# EAGLE design board-forblock (EAGLE 9.5.2)
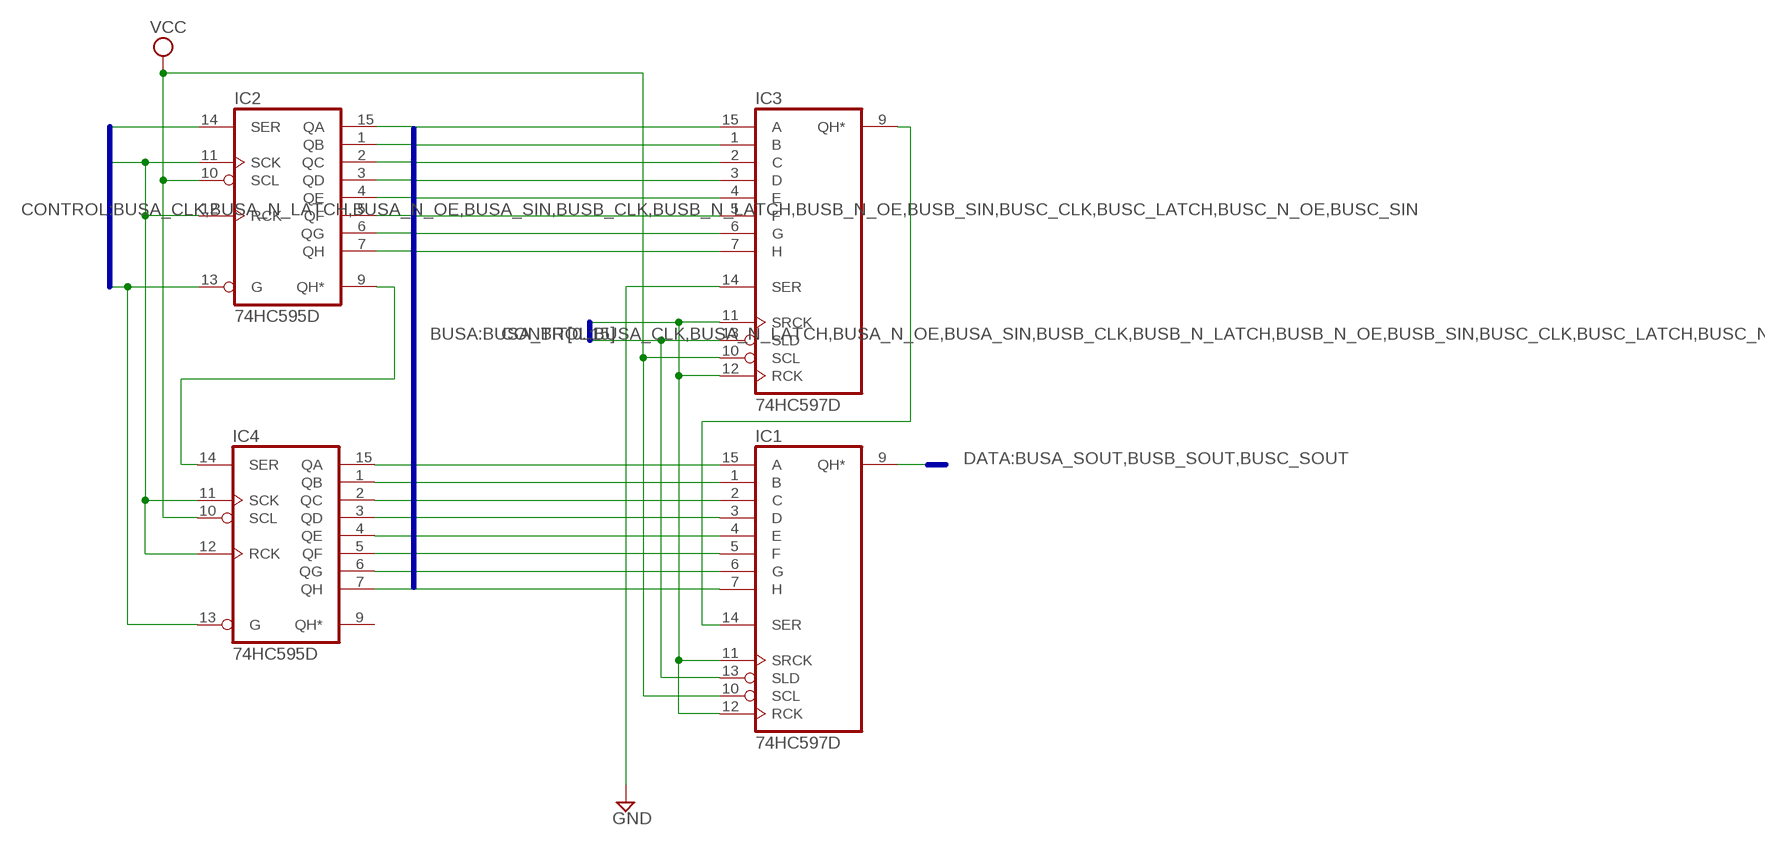
[diagram p0: schematic, sheet 1]

## Parts
IC1  74HC597D  [SO16]
IC2  74HC595D  [SO16]
IC3  74HC597D  [SO16]
IC4  74HC595D  [SO16]

## Nets
BUSA_BIT0: IC2.15(QA) IC3.15(A)
BUSA_BIT1: IC2.1(QB) IC3.1(B)
BUSA_BIT2: IC2.2(QC) IC3.2(C)
BUSA_BIT3: IC2.3(QD) IC3.3(D)
BUSA_BIT4: IC2.4(QE) IC3.4(E)
BUSA_BIT5: IC2.5(QF) IC3.5(F)
BUSA_BIT6: IC2.6(QG) IC3.6(G)
BUSA_BIT7: IC2.7(QH) IC3.7(H)
BUSA_BIT8: IC1.15(A) IC4.15(QA)
BUSA_BIT9: IC1.1(B) IC4.1(QB)
BUSA_BIT10: IC1.2(C) IC4.2(QC)
BUSA_BIT11: IC1.3(D) IC4.3(QD)
BUSA_BIT12: IC1.4(E) IC4.4(QE)
BUSA_BIT13: IC1.5(F) IC4.5(QF)
BUSA_BIT14: IC1.6(G) IC4.6(QG)
BUSA_BIT15: IC1.7(H) IC4.7(QH)
BUSA_CLK: IC1.11(SRCK) IC1.12(RCK) IC2.11(SCK) IC2.12(RCK) IC3.11(SRCK) IC3.12(RCK) IC4.11(SCK) IC4.12(RCK)
BUSA_N_LATCH: IC1.13(SLD) IC3.13(SLD)
BUSA_N_OE: IC2.13(G) IC4.13(G)
BUSA_SIN: IC2.14(SER)
BUSA_SOUT: IC1.9(QH*)
GND: IC3.14(SER)
N$1: IC2.9(QH*) IC4.14(SER)
N$2: IC1.14(SER) IC3.9(QH*)
VCC: IC1.10(SCL) IC2.10(SCL) IC3.10(SCL) IC4.10(SCL)
Unconnected: IC4.9(QH*)

## Buses
BUSA:BUSA_BIT[0..15]
CONTROL:BUSA_CLK,BUSA_N_LATCH,BUSA_N_OE,BUSA_SIN,BUSB_CLK,BUSB_N_LATCH,BUSB_N_OE,BUSB_SIN,BUSC_CLK,BUSC_LATCH,BUSC_N_OE,BUSC_SIN
DATA:BUSA_SOUT,BUSB_SOUT,BUSC_SOUT

## Power pins joined to a net without a drawn wire
GND: IC1.8(GND) IC2.8(GND) IC3.8(GND) IC4.8(GND)
VCC: IC1.16(VCC) IC2.16(VCC) IC3.16(VCC) IC4.16(VCC)

## Library data of the parts
IC1 IC3 = 74xx-eu:74*597: 8-bit SHIFT REGISTER, input latch
IC2 IC4 = 74xx-eu:74*595: 8-bit SHIFT REGISTER, output latch

## Board
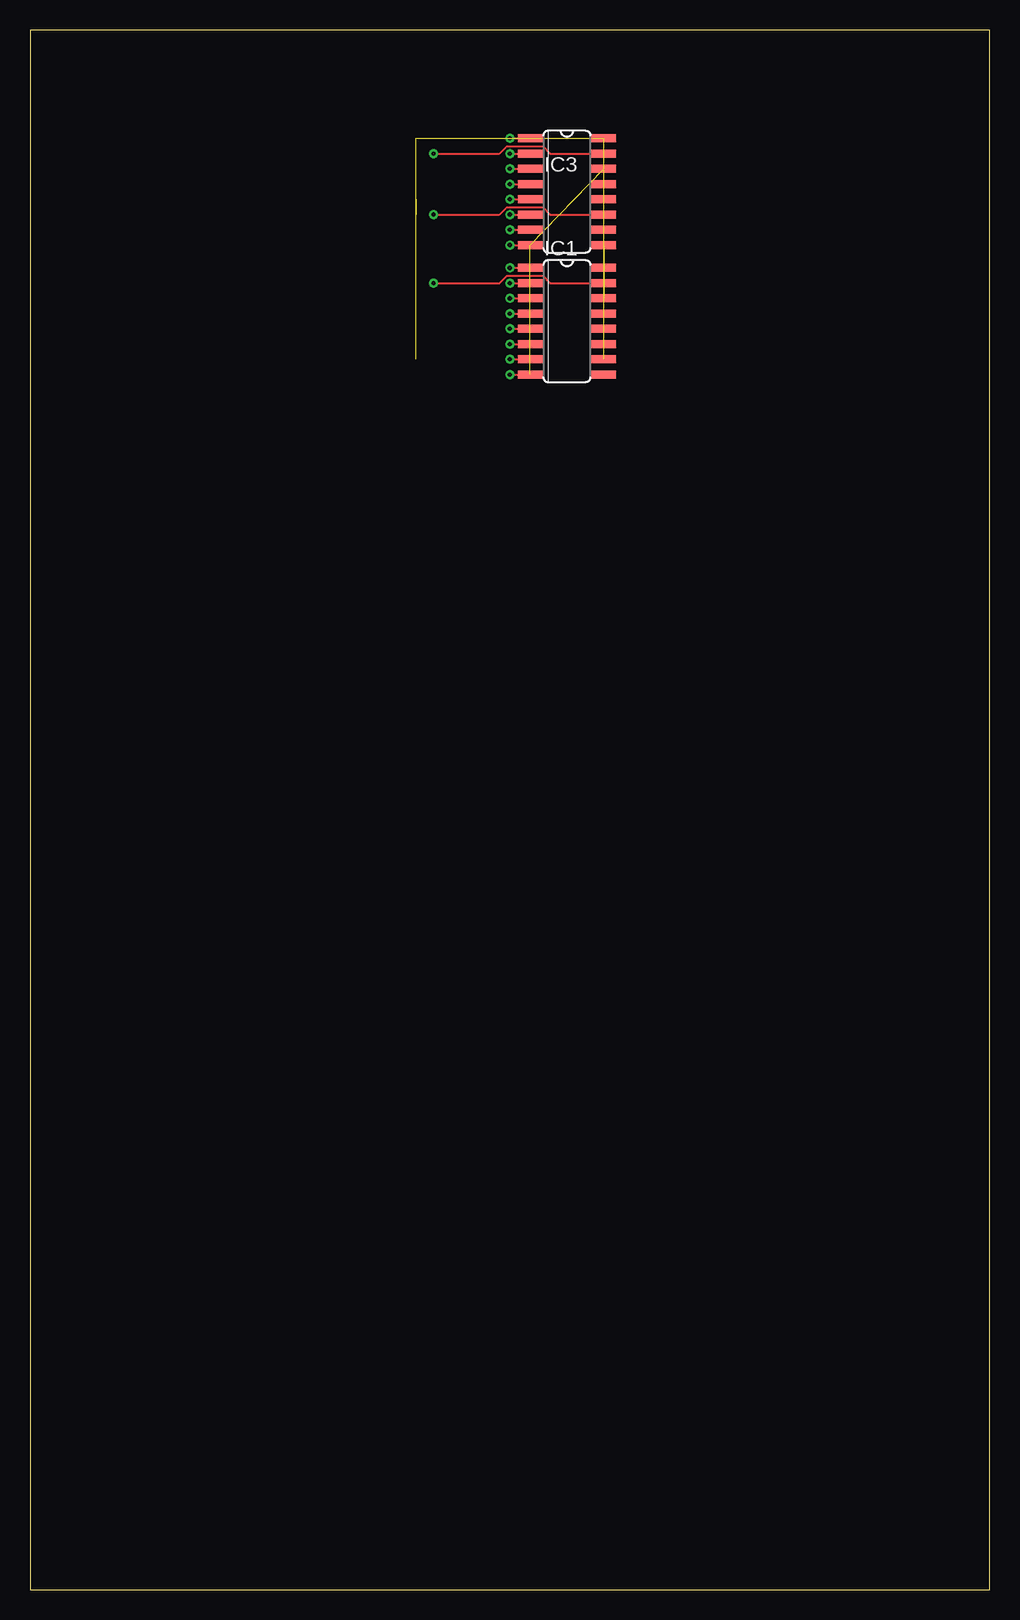
[diagram p1: board, top side]
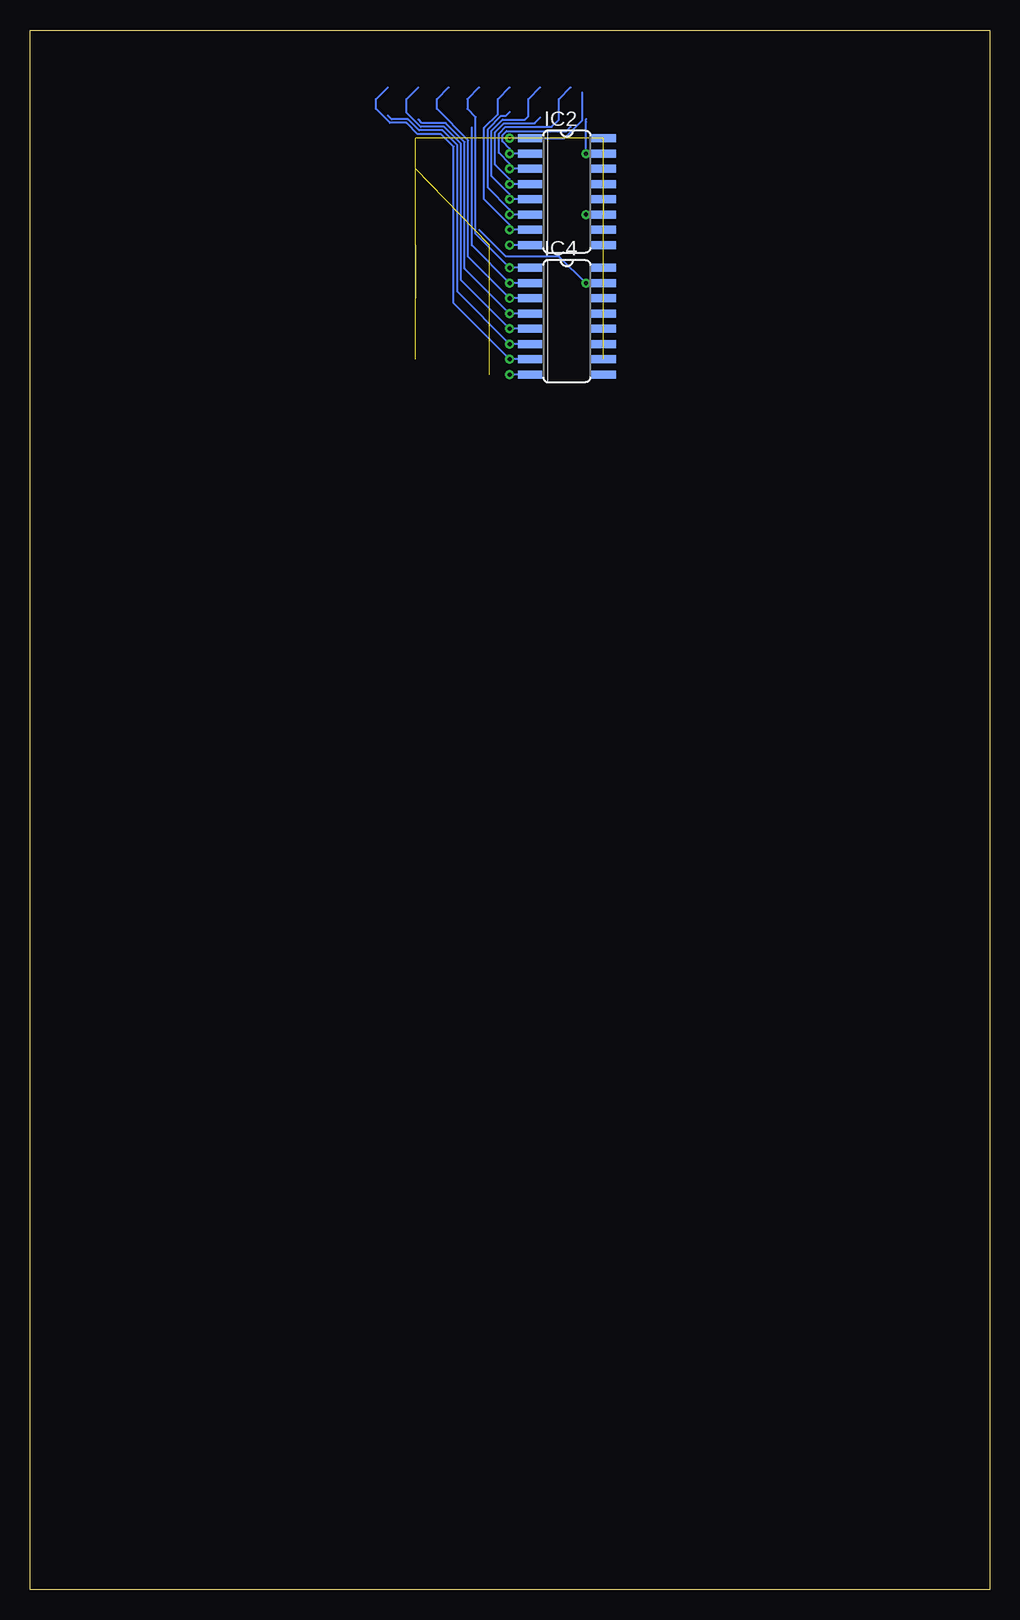
[diagram p2: board, bottom side, seen from below]

Size 80 x 130 mm. Coordinates in mm from the lower left corner, seen from the top.
Outline: 0,0 80,0 80,130 0,130 0,0
Copper layers (1*16): Top 0.035mm / dielectric 1.5mm / Bottom 0.035mm
Design rules "default": minimum track width 6mil, minimum drill 0.35mm, track to track 6mil, track to pad 6mil, pad to pad 6mil, via to via 6mil, smd to smd 6mil, copper to edge 40mil, drill to drill 6mil, minimum pad ring 10mil, minimum via ring 8mil, stop-mask expansion 4mil, vias tented up to drill 0mil, thermal gap 10mil

### Footprints (pad centres in the part's own frame; a part is rotated, then mirrored left to right if it is on the bottom)
SO16 = smd 0.66 x 2.032: 1 -4.445,-3.073; 2 -3.175,-3.073; 3 -1.905,-3.073; 4 -0.635,-3.073; 5 0.635,-3.073; 6 1.905,-3.073; 7 3.175,-3.073; 8 4.445,-3.073; 9 4.445,3.073; 10 3.175,3.073; 11 1.905,3.073; 12 0.635,3.073; 13 -0.635,3.073; 14 -1.905,3.073; 15 -3.175,3.073; 16 -4.445,3.073

### Placement (x,y rotation side)
IC1  44.77,105.73 270 top
IC2  35.24,116.52 270 bottom
IC3  44.77,116.52 270 top
IC4  35.24,105.73 270 bottom

### Tracks (layer width: path | path; a pad name or v marks a point on that pad's centre or on a via)
BUSA_BIT0  (via drill 0.35)  (1 unrouted)
  Top 0.152: v33.66,119.7 39.15,119.7 39.75,120.3 42.76,120.3 43.36,119.7 IC3.15
  Bottom 0.152: IC2.15 v33.66,119.7 33.66,122.33 33.64,122.34 33.64,122.57
BUSA_BIT1  (via drill 0.35)
  Top 0.152: v40.01,120.97 IC3.1
  Bottom 0.152: v40.01,120.97 IC2.1 35.45,120.97 33.94,122.47 33.94,124.81
BUSA_BIT2  (via drill 0.35)
  Top 0.152: v40.01,119.7 IC3.2
  Bottom 0.152: IC2.2 v40.01,119.7 40.01,120.11 40.61,120.72 40.61,121.22 40.26,121.57 35.27,121.57 34.92,121.92
BUSA_BIT3  (via drill 0.35)
  Top 0.152: v40.01,118.43 IC3.3
  Bottom 0.152: IC2.3 v40.01,118.43 40.01,118.84 40.92,119.75 40.92,121.34 40.34,121.92 36.51,121.92 35.91,122.53 35.91,124.23 34.92,125.22
BUSA_BIT4  (via drill 0.35)
  Top 0.152: v40.01,117.16 IC3.4
  Bottom 0.152: IC2.4 v40.01,117.16 40.01,117.57 41.22,118.79 41.22,121.47 40.47,122.22 37.94,122.22 37.47,122.69
BUSA_BIT5  (via drill 0.35)
  Top 0.152: v40.01,115.89 IC3.5
  Bottom 0.152: IC2.5 v40.01,115.89 40.01,116.3 41.53,117.82 41.53,121.6 40.59,122.53 38.73,122.53 38.45,122.82 38.45,124.23 37.47,125.22
BUSA_BIT6  (via drill 0.35)
  Top 0.152: v40.01,114.62 IC3.6
  Bottom 0.152: IC2.6 v40.01,114.62 40.01,115.03 41.83,116.86 41.83,121.72 40.72,122.83 40.32,122.83 40.01,123.15
BUSA_BIT7  (via drill 0.35)
  Top 0.152: v40.01,113.35 IC3.7
  Bottom 0.152: IC2.7 v40.01,113.35 40.01,113.76 42.14,115.89 42.14,121.85 40.99,123 40.99,124.23 40.01,125.22
BUSA_BIT8  (via drill 0.35)  (1 unrouted)
  Top 0.152: v33.66,108.9 39.15,108.9 39.75,109.51 42.76,109.51 43.36,108.9 IC1.15
  Bottom 0.152: IC4.15 v33.66,108.9 35.88,111.12 40.32,111.12 42.55,113.35
BUSA_BIT9  (via drill 0.35)
  Top 0.152: v40.01,110.17 IC1.1
  Bottom 0.152: IC4.1 v40.01,110.17 42.85,113.02 42.85,122.74 43.53,123.42 43.53,124.23 42.55,125.22
BUSA_BIT10  (via drill 0.35)
  Top 0.152: v40.01,108.9 IC1.2
  Bottom 0.152: IC4.2 v40.01,108.9 43.16,112.05 43.16,112.46 43.16,119.38 43.16,121.89
BUSA_BIT11  (via drill 0.35)
  Top 0.152: v40.01,107.63 IC1.3
  Bottom 0.152: IC4.3 v40.01,107.63 43.46,111.09 43.46,120.81 46.07,123.42 46.07,124.23 45.09,125.22
BUSA_BIT12  (via drill 0.35)
  Top 0.152: v40.01,106.36 IC1.4
  Bottom 0.152: IC4.4 v40.01,106.36 43.76,110.12 43.76,120.65 45.35,122.24 47.31,122.24 47.62,122.56
BUSA_BIT13  (via drill 0.35)
  Top 0.152: v40.01,105.09 IC1.5
  Bottom 0.152: IC4.5 v40.01,105.09 44.07,109.16 44.07,120.52 45.48,121.93 47.43,121.93 48.61,123.11 48.61,124.23 47.62,125.22
BUSA_BIT14  (via drill 0.35)
  Top 0.152: v40.01,103.82 IC1.6
  Bottom 0.152: IC4.6 v40.01,103.82 44.37,108.19 44.37,120.4 45.6,121.63 47.56,121.63 48.49,122.56 49.85,122.56 50.16,122.87
BUSA_BIT15  (via drill 0.35)
  Top 0.152: v40.01,102.55 IC1.7
  Bottom 0.152: IC4.7 v40.01,102.55 44.68,107.23 44.68,120.27 45.73,121.32 47.69,121.32 48.61,122.25 49.98,122.25 51.15,123.42 51.15,124.23 50.16,125.22
BUSA_CLK  (via drill 0.35)  (6 unrouted)
  Top 0.152: v33.66,114.62 39.15,114.62 39.75,115.22 42.76,115.22 43.36,114.62 IC3.11
  Bottom 0.152: IC2.11 v33.66,114.62
BUSA_N_LATCH  (1 unrouted)
BUSA_N_OE  (1 unrouted)
GND  (via drill 0.35)  (2 unrouted)
  Top 0.152: v40.01,112.08 IC3.8 | v40.01,101.28 IC1.8
  Bottom 0.152: IC2.8 v40.01,112.08 | IC4.8 v40.01,101.28
N$1  (1 unrouted)
N$2  (1 unrouted)
VCC  (7 unrouted)